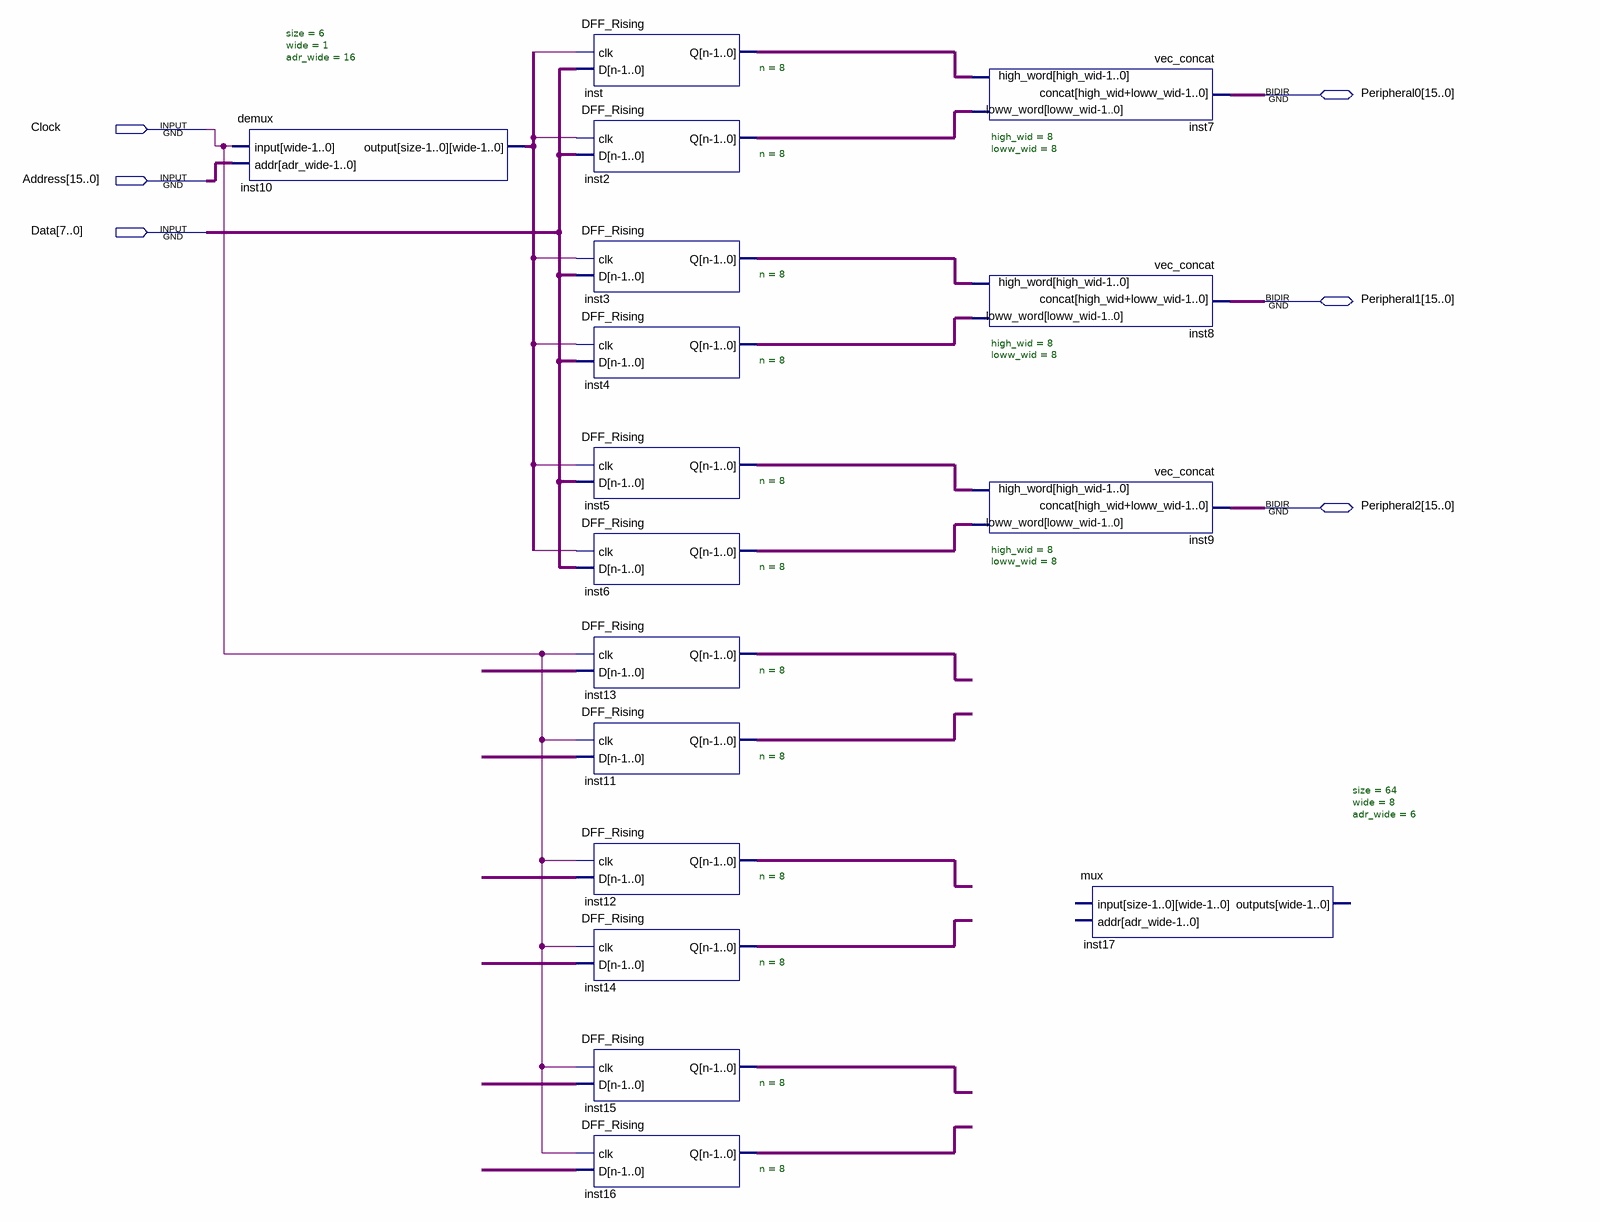
[diagram p0: schematic sheet]
// Quartus schematic conceptP.bdf as structural Verilog: 17 symbols, 6 pins
module conceptP (
  input  Clock,
  input  [15:0] Address,
  input  [7:0] Data,
  inout  [15:0] Peripheral0,
  inout  [15:0] Peripheral1,
  inout  [15:0] Peripheral2
);

  wire undriven_7, undriven_8, undriven_9, undriven_10, undriven_11, undriven_12;
  wire [5:0] inst10_output;
  wire [7:0] inst2_q, inst3_q, inst4_q, inst5_q, inst6_q, inst11_q, inst12_q, inst13_q, inst14_q, inst15_q,
       inst16_q, inst_q, undriven, undriven_2, undriven_3, undriven_4, undriven_5, undriven_6;

  demux #(.size(6), .wide(1), .adr_wide(16)) inst10 (.\input (Clock), .addr(Address), .\output (inst10_output));
  DFF_Rising #(.n(8)) inst (.clk(undriven_7), .D(Data), .Q(inst_q));
  DFF_Rising #(.n(8)) inst2 (.clk(undriven_8), .D(Data), .Q(inst2_q));
  DFF_Rising #(.n(8)) inst3 (.clk(undriven_9), .D(Data), .Q(inst3_q));
  DFF_Rising #(.n(8)) inst4 (.clk(undriven_10), .D(Data), .Q(inst4_q));
  DFF_Rising #(.n(8)) inst5 (.clk(undriven_11), .D(Data), .Q(inst5_q));
  DFF_Rising #(.n(8)) inst6 (.clk(undriven_12), .D(Data), .Q(inst6_q));
  DFF_Rising #(.n(8)) inst13 (.clk(Clock), .D(undriven), .Q(inst13_q));
  DFF_Rising #(.n(8)) inst11 (.clk(Clock), .D(undriven_2), .Q(inst11_q));
  DFF_Rising #(.n(8)) inst12 (.clk(Clock), .D(undriven_3), .Q(inst12_q));
  DFF_Rising #(.n(8)) inst14 (.clk(Clock), .D(undriven_4), .Q(inst14_q));
  DFF_Rising #(.n(8)) inst15 (.clk(Clock), .D(undriven_5), .Q(inst15_q));
  DFF_Rising #(.n(8)) inst16 (.clk(Clock), .D(undriven_6), .Q(inst16_q));
  vec_concat #(.high_wid(8), .loww_wid(8)) inst7 (.high_word(inst_q), .loww_word(inst2_q), .concat(Peripheral0));
  vec_concat #(.high_wid(8), .loww_wid(8)) inst8 (.high_word(inst3_q), .loww_word(inst4_q), .concat(Peripheral1));
  vec_concat #(.high_wid(8), .loww_wid(8)) inst9 (.high_word(inst5_q), .loww_word(inst6_q), .concat(Peripheral2));
  mux #(.size(64), .wide(8), .adr_wide(6)) inst17 ();  // open: input, addr, outputs
endmodule
